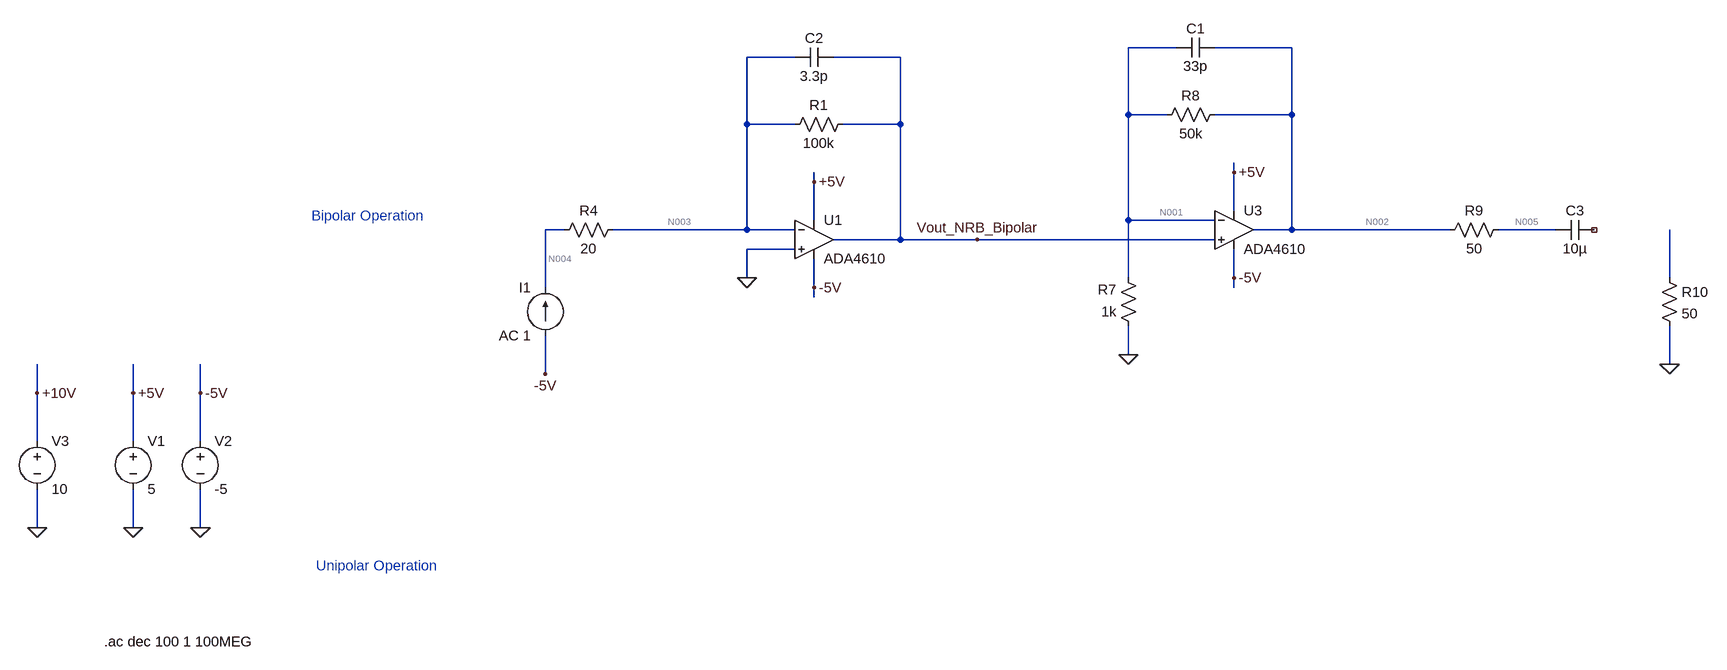
[diagram p0: schematic TIA_Preamp_Linedriver_AC.asc]
TIA_Preamp_Linedriver_AC.asc, the LTspice schematic file:
Version 4
SHEET 1 3412 768
WIRE 1888 -560 1808 -560
WIRE 2080 -560 1952 -560
WIRE 1232 -544 1152 -544
WIRE 1408 -544 1296 -544
WIRE 1808 -448 1808 -560
WIRE 1872 -448 1808 -448
WIRE 2080 -448 2080 -560
WIRE 2080 -448 1952 -448
WIRE 1152 -432 1152 -544
WIRE 1232 -432 1152 -432
WIRE 1408 -432 1408 -544
WIRE 1408 -432 1312 -432
WIRE 1984 -352 1984 -368
WIRE 1264 -336 1264 -352
WIRE 1984 -288 1984 -352
WIRE 1264 -272 1264 -336
WIRE 1808 -272 1808 -448
WIRE 1952 -272 1808 -272
WIRE 848 -256 816 -256
WIRE 1152 -256 1152 -432
WIRE 1152 -256 928 -256
WIRE 1232 -256 1152 -256
WIRE 2080 -256 2080 -448
WIRE 2080 -256 2016 -256
WIRE 2416 -256 2080 -256
WIRE 2592 -256 2496 -256
WIRE 1408 -240 1408 -432
WIRE 1408 -240 1296 -240
WIRE 1536 -240 1408 -240
WIRE 1952 -240 1536 -240
WIRE 1232 -224 1152 -224
WIRE 1152 -176 1152 -224
WIRE 1808 -176 1808 -272
WIRE 1984 -176 1984 -224
WIRE 2880 -176 2880 -256
WIRE 816 -160 816 -256
WIRE 1264 -160 1264 -208
WIRE 1984 -160 1984 -176
WIRE 1264 -144 1264 -160
WIRE 1808 -48 1808 -96
WIRE 2880 -32 2880 -96
WIRE 816 -16 816 -80
WIRE -1008 16 -1008 -32
WIRE -848 16 -848 -32
WIRE -736 16 -736 -32
WIRE -1008 96 -1008 16
WIRE -848 96 -848 16
WIRE -736 96 -736 16
WIRE -1008 240 -1008 176
WIRE -848 240 -848 176
WIRE -736 240 -736 176
FLAG -848 240 0
FLAG -848 16 +5V
FLAG -736 240 0
FLAG -736 16 -5V
FLAG 1264 -160 -5V
FLAG 1264 -336 +5V
FLAG 816 -16 -5V
FLAG 1152 -176 0
FLAG 1536 -240 Vout_NRB_Bipolar
FLAG -1008 240 0
FLAG -1008 16 +10V
FLAG 1984 -176 -5V
FLAG 1984 -352 +5V
FLAG 1808 -48 0
FLAG 2880 -32 0
SYMBOL OpAmps\\ADA4610 1264 -304 R0
SYMATTR InstName U1
SYMBOL voltage -848 80 R0
WINDOW 123 0 0 Left 0
WINDOW 39 0 0 Left 0
SYMATTR InstName V1
SYMATTR Value 5
SYMBOL voltage -736 80 R0
WINDOW 123 0 0 Left 0
WINDOW 39 0 0 Left 0
SYMATTR InstName V2
SYMATTR Value -5
SYMBOL res 1328 -448 R90
WINDOW 0 0 56 VBottom 2
WINDOW 3 32 56 VTop 2
SYMATTR InstName R1
SYMATTR Value 100k
SYMBOL cap 1232 -528 R270
WINDOW 0 32 32 VTop 2
WINDOW 3 0 32 VBottom 2
SYMATTR InstName C2
SYMATTR Value 3.3p
SYMBOL res 944 -272 R90
WINDOW 0 0 56 VBottom 2
WINDOW 3 32 56 VTop 2
SYMATTR InstName R4
SYMATTR Value 20
SYMBOL voltage -1008 80 R0
WINDOW 123 0 0 Left 0
WINDOW 39 0 0 Left 0
SYMATTR InstName V3
SYMATTR Value 10
SYMBOL OpAmps\\ADA4610 1984 -320 R0
SYMATTR InstName U3
SYMBOL res 1824 -80 R180
WINDOW 0 36 76 Left 2
WINDOW 3 36 40 Left 2
SYMATTR InstName R7
SYMATTR Value 1k
SYMBOL res 1856 -432 R270
WINDOW 0 32 56 VTop 2
WINDOW 3 0 56 VBottom 2
SYMATTR InstName R8
SYMATTR Value 50k
SYMBOL res 2512 -272 R90
WINDOW 0 0 56 VBottom 2
WINDOW 3 32 56 VTop 2
SYMATTR InstName R9
SYMATTR Value 50
SYMBOL res 2864 -192 R0
SYMATTR InstName R10
SYMATTR Value 50
SYMBOL current 816 -80 R180
WINDOW 0 24 80 Left 2
WINDOW 3 24 0 Left 2
WINDOW 123 0 0 Left 0
WINDOW 39 0 0 Left 0
SYMATTR InstName I1
SYMATTR Value AC 1
SYMBOL cap 1888 -544 R270
WINDOW 0 32 32 VTop 2
WINDOW 3 0 32 VBottom 2
SYMATTR InstName C1
SYMATTR Value 33p
SYMBOL cap 2592 -240 R270
WINDOW 0 32 32 VTop 2
WINDOW 3 0 32 VBottom 2
SYMATTR InstName C3
SYMATTR Value 10µ
TEXT -896 520 Left 2 !.ac dec 100 1 100MEG
TEXT -144 -280 Left 2 ;Bipolar Operation
TEXT -136 304 Left 2 ;Unipolar Operation

The netlist it stands for:
* TIA_Preamp_Linedriver_AC.asc
XU1 0 N003 +5V -5V Vout_NRB_Bipolar ADA4610  ; pins In+ In- V+ V- OUT
V1 +5V 0 5
V2 -5V 0 -5
R1 Vout_NRB_Bipolar N003 100k
C2 N003 Vout_NRB_Bipolar 3.3p
R4 N003 N004 20
V3 +10V 0 10
XU3 Vout_NRB_Bipolar N001 +5V -5V N002 ADA4610  ; pins In+ In- V+ V- OUT
R7 0 N001 1k
R8 N001 N002 50k
R9 N005 N002 50
R10 N006 0 50
I1 -5V N004 AC 1
C1 N001 N002 33p
C3 N005 NC_01 10µ
.ac dec 100 1 100MEG
* Bipolar Operation
* Unipolar Operation
.backanno
.end

* Results of the author's LTspice run, read from the files saved beside the schematic
* Operating Point, zero values left out:
*   V(+5v) = 5 V
*   V(-5v) = -5 V
*   V(n003) = -203.1 nV
*   V(vout_nrb_bipolar) = -503.1 nV
*   V(n004) = -203.1 nV
*   V(+10v) = 10 V
*   V(n001) = -705.3 nV
*   V(n002) = -36.12 µV
*   V(n005) = -36.12 µV
*   I(R8) = 708.3 pA
*   I(R7) = 705.3 pA
*   I(R1) = -3 pA
*   I(V2) = 6.601 mA
*   I(V1) = -6.601 mA
*   Ix(u1:100) = -3.333 pA
*   Ix(u1:101) = -3 pA
*   Ix(u1:102) = 3.301 mA
*   Ix(u1:103) = -3.301 mA
*   Ix(u1:104) = 6.333 pA
*   Ix(u3:100) = -3.333 pA
*   Ix(u3:101) = -3 pA
*   Ix(u3:102) = 3.301 mA
*   Ix(u3:103) = -3.301 mA
*   Ix(u3:104) = 708.3 pA
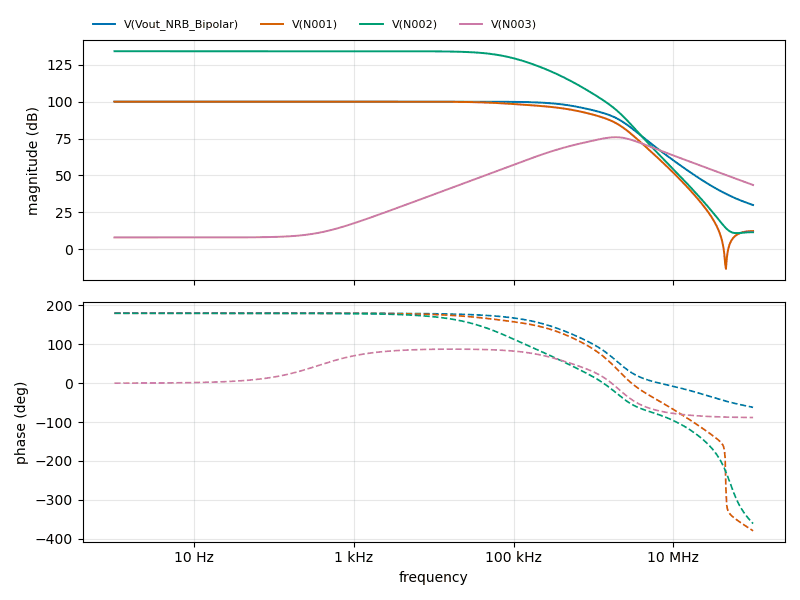
[diagram p1: AC Analysis of TIA_Preamp_Linedriver_AC.asc, plotted from the saved traces]
* AC Analysis, 1 run:
*   V(Vout_NRB_Bipolar): 100.00 dB at 1 Hz, 29.98 dB at 100 MHz, peak 100.00 dB at 1 Hz, 3 dB below the peak at 559.8 kHz
*   V(N001): 99.99 dB at 1 Hz, 12.35 dB at 100 MHz, peak 99.99 dB at 1 Hz, 3 dB below the peak at 228 kHz
*   V(N002): 134.14 dB at 1 Hz, 11.56 dB at 100 MHz, peak 134.14 dB at 1 Hz, 3 dB below the peak at 71.52 kHz
*   V(N003): 8.02 dB at 1 Hz, 43.55 dB at 100 MHz, peak 75.92 dB at 1.905 MHz, 3 dB below the peak at 867.3 kHz and 3.489 MHz